# EasyEDA schematic HW1_2.json
TITLE: Sheet_1; REV: 1.0; Date: 2020-11-04; Sheet: 1/1; Drawn By: gokbeykeskin_4066; Company: Your Company
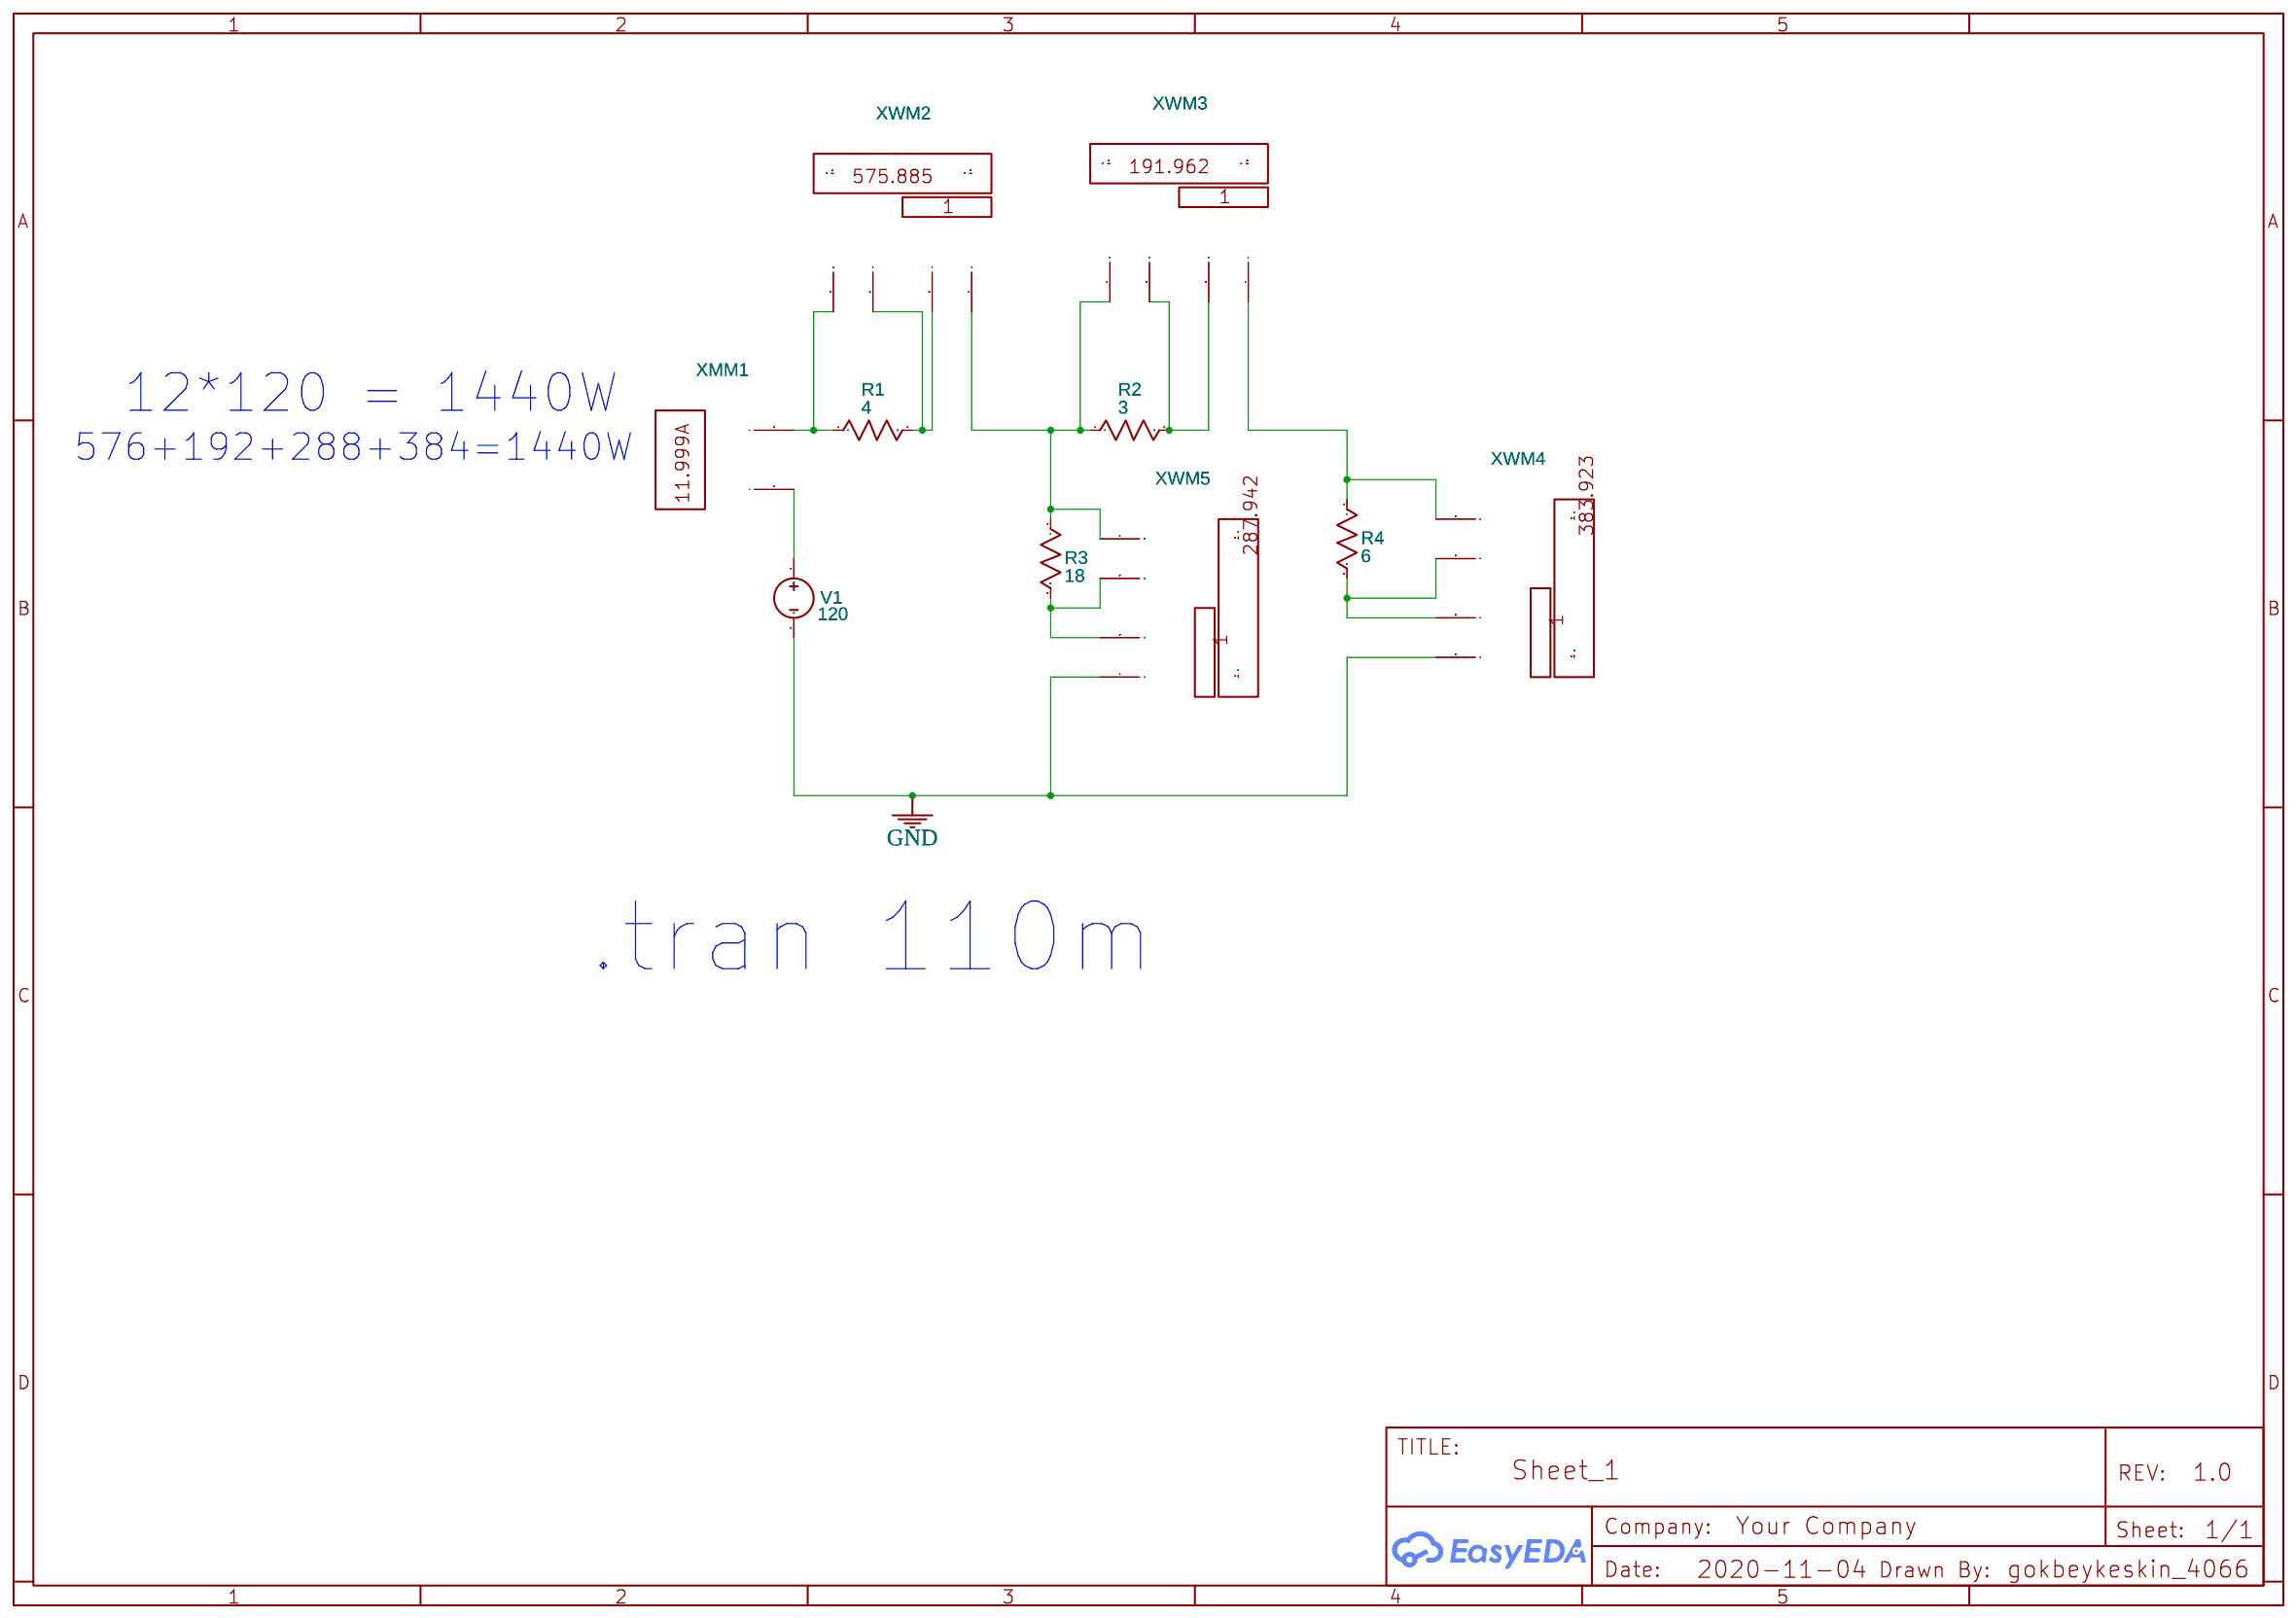
[diagram p0: schematic sheet]

## Parts
R1  4  [AXIAL-0.3]
R2  3  [AXIAL-0.3]
R3  18  [AXIAL-0.3]
R4  6  [AXIAL-0.3]
V1  120  [HDR1X2]
XMM1  Multimeter
XWM2  Wattmeter
XWM3  Wattmeter
XWM4  Wattmeter
XWM5  Wattmeter

## Library data of the parts
R1-R4 = Resistor_US: Resistance: 1k; Contributor: EasyEDA; Supplier: YUJING
V1 = VDC: Contributor: EasyEDA; sim: true
XMM1 = MULTIMETER: Supplier: LCSC; Multimeter Type: Amper; Power Type: AC; Voltmeter resistance: 10μ; Ammeter resistance: 1G; NameDisplay: 0; Contributor: EasyEDA; sim: true
XWM2-XWM5 = WATTMETER: Contributor: EasyEDA; NameDisplay: 0; sim: true

## Nets
GND: V1.2 XWM4.4(I-) XWM5.4(I-)
Net-(R1-1): R1.1 XMM1.2(I) XWM2.1(V+)
Net-(R1-2): R1.2 XWM2.2(V-) XWM2.3(I+)
Net-(R2-1): R2.1 R3.1 XWM2.4(I-) XWM3.1(V+) XWM5.1(V+)
Net-(R2-2): R2.2 XWM3.2(V-) XWM3.3(I+)
Net-(R3-2): R3.2 XWM5.2(V-) XWM5.3(I+)
Net-(R4-1): R4.1 XWM3.4(I-) XWM4.1(V+)
Net-(R4-2): R4.2 XWM4.2(V-) XWM4.3(I+)
Net-(V1-1): V1.1 XMM1.1(+)

Not connected (* = marked no-connect by the designer): XWM2 P PF; XWM3 P PF; XWM4 P PF; XWM5 P PF

## Notes on the sheet
- 12*120 = 1440W
- 576+192+288+384=1440W
- .tran 110m
